# EAGLE design Sensor AFE Explorer Rev1 (EAGLE 6.3)
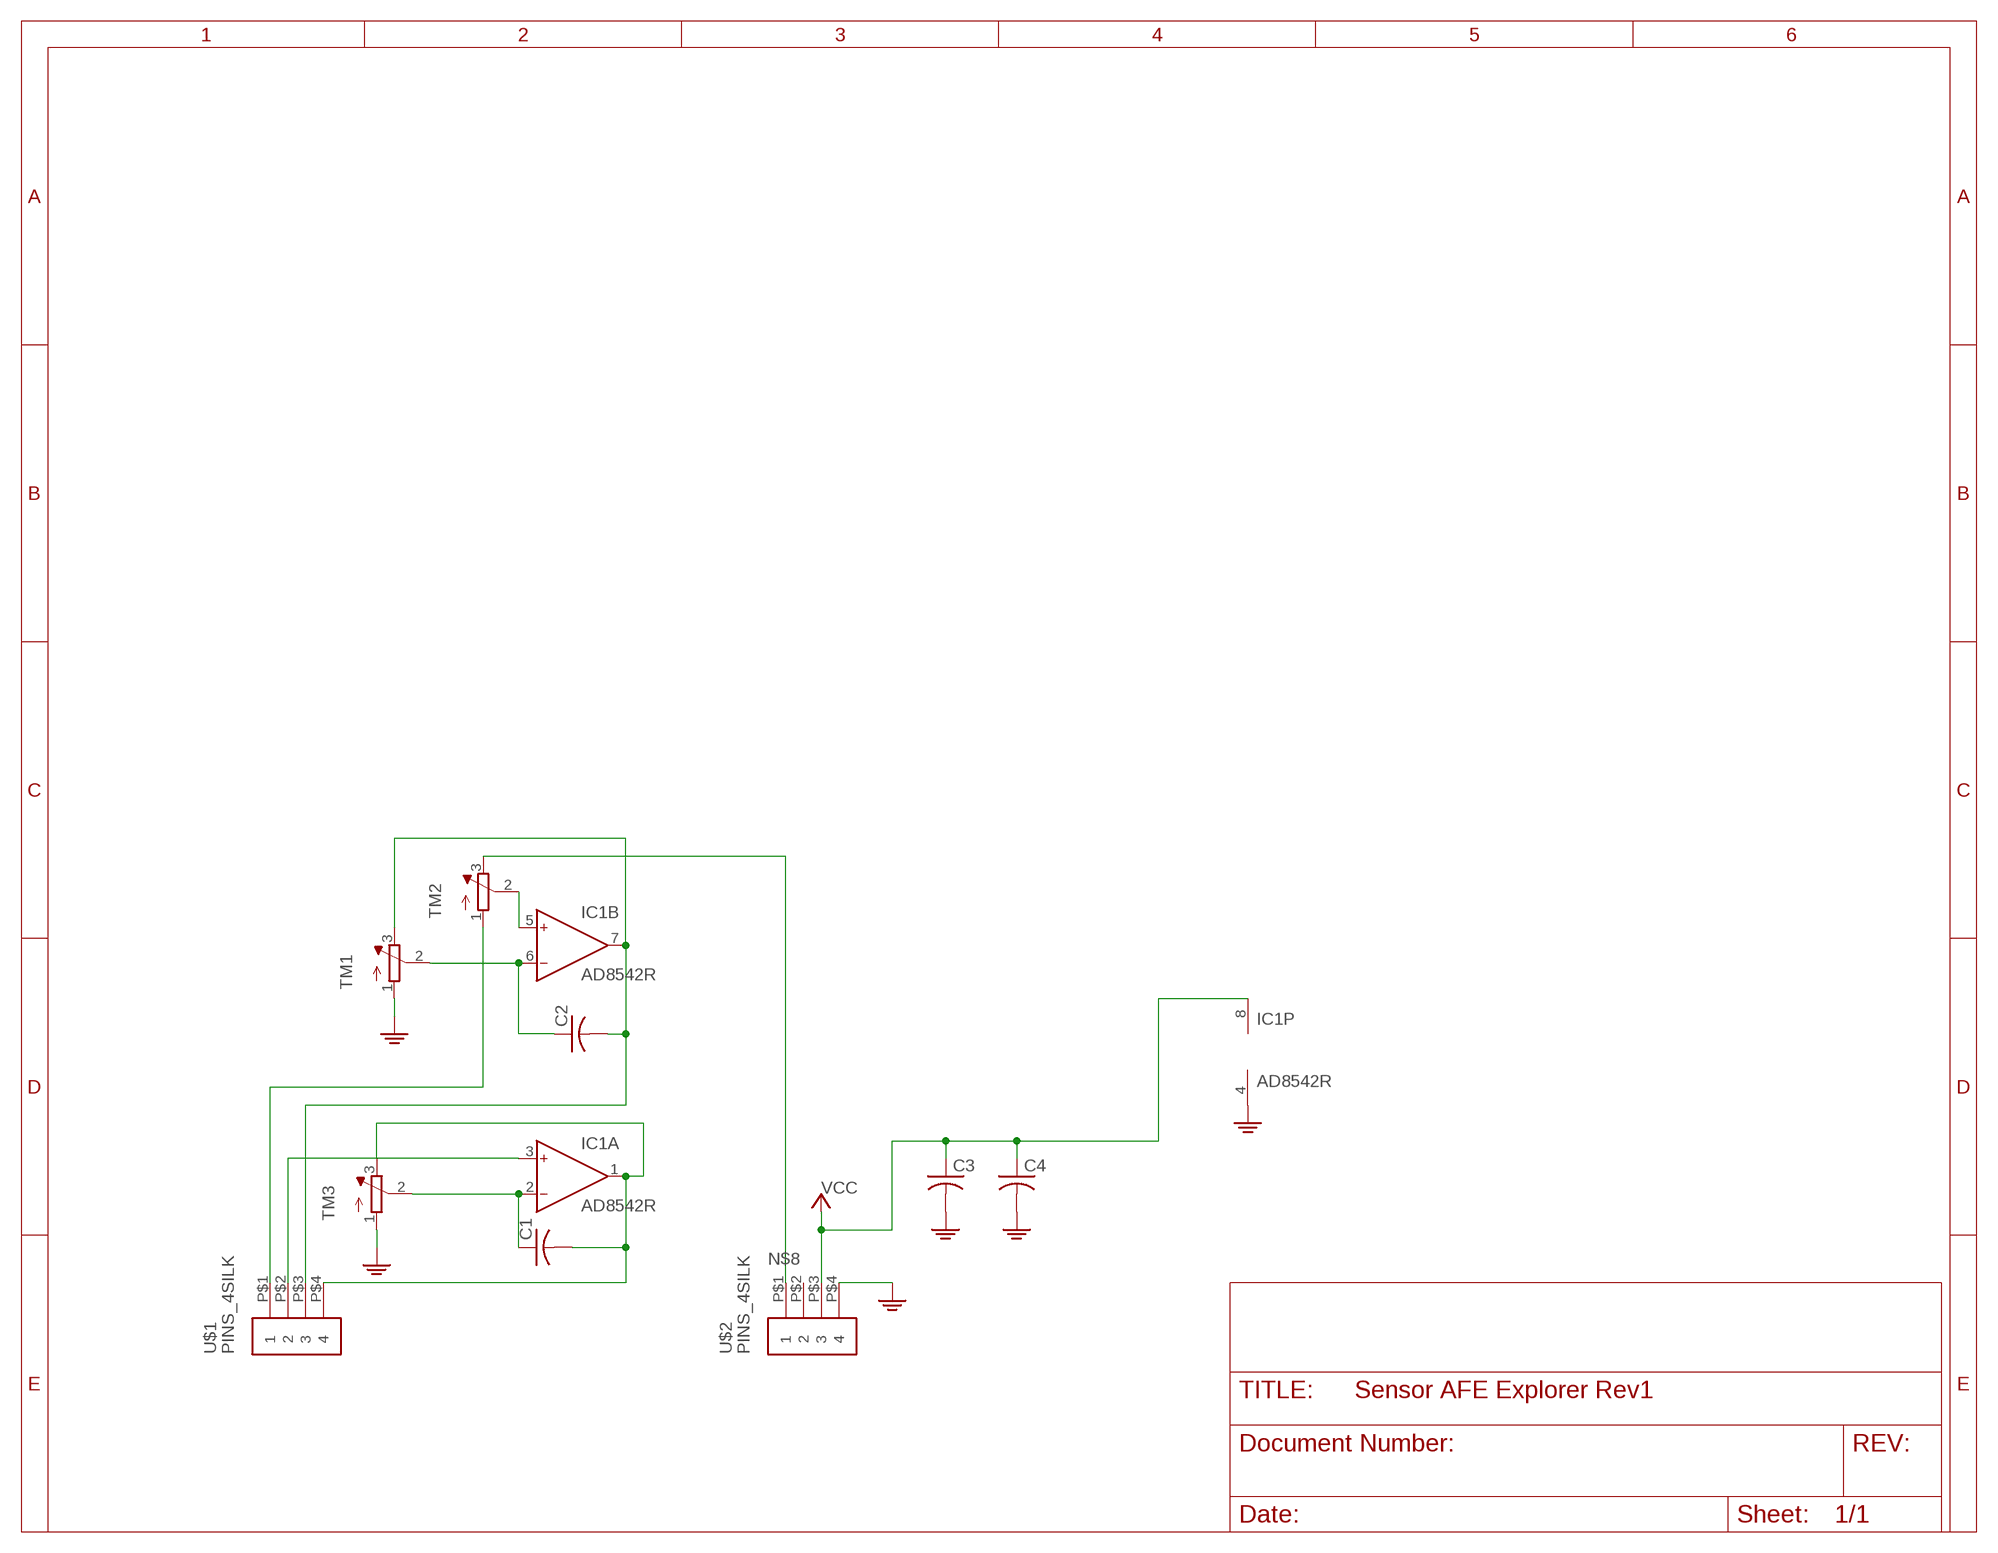
[diagram p0: schematic, sheet 1]

## Parts
C1  C-USC0805  [C0805]
C2  C-USC0805  [C0805]
C3  C-USC0805  [C0805]
C4  C-USC0805  [C0805]
IC1  AD8542R  [SO8]
TM1  TRIMPOT3386  [TRIM-3386]
TM2  TRIMPOT3386  [TRIM-3386]
TM3  TRIMPOT3386  [TRIM-3386]
U$1  PINS_4SILK  [PCB_4]
U$2  PINS_4SILK  [PCB_4]

## Nets
GND: C3.2 C4.2 IC1.4(P:V-) TM1.1(A) TM3.1(A) U$2.P$4
N$1: C2.1 IC1.6(B:IN-) TM1.2(S)
N$2: C2.2 IC1.7(B:OUT) TM1.3(E) U$1.P$3
N$3: C1.1 IC1.2(A:IN-) TM3.2(S)
N$4: C1.2 IC1.1(A:OUT) TM3.3(E) U$1.P$4
N$5: IC1.3(A:IN+) U$1.P$2
N$6: TM2.1(A) U$1.P$1
N$7: IC1.5(B:IN+) TM2.2(S)
N$8: TM2.3(E) U$2.P$1
VCC: C3.1 C4.1 IC1.8(P:V+) U$2.P$3
Unconnected: U$2.P$2

## Library data of the parts
C1-C4 = nolan-utsa:C-US: CAPACITOR, American symbol
IC1 = analog-devices:AD8542: General-Purpose CMOS Rail-to-Rail Amplifiers Source: http://www.analog.com/static/imported-files/data_sheets/AD8541_8542_8544.pdf; MF: ALTERA CORPORATION; MPN: AD8542ARZ-REEL; OC_FARNELL: 1424150; OC_NEWARK: 59K6827
TM1-TM3 = nolan-utsa:TRIMPOT: SMT trimmer potentiometer part number TC33X http://www.ladyada.net/library/eagle
U$1 U$2 = nolan-utsa:PINS_4

## Board
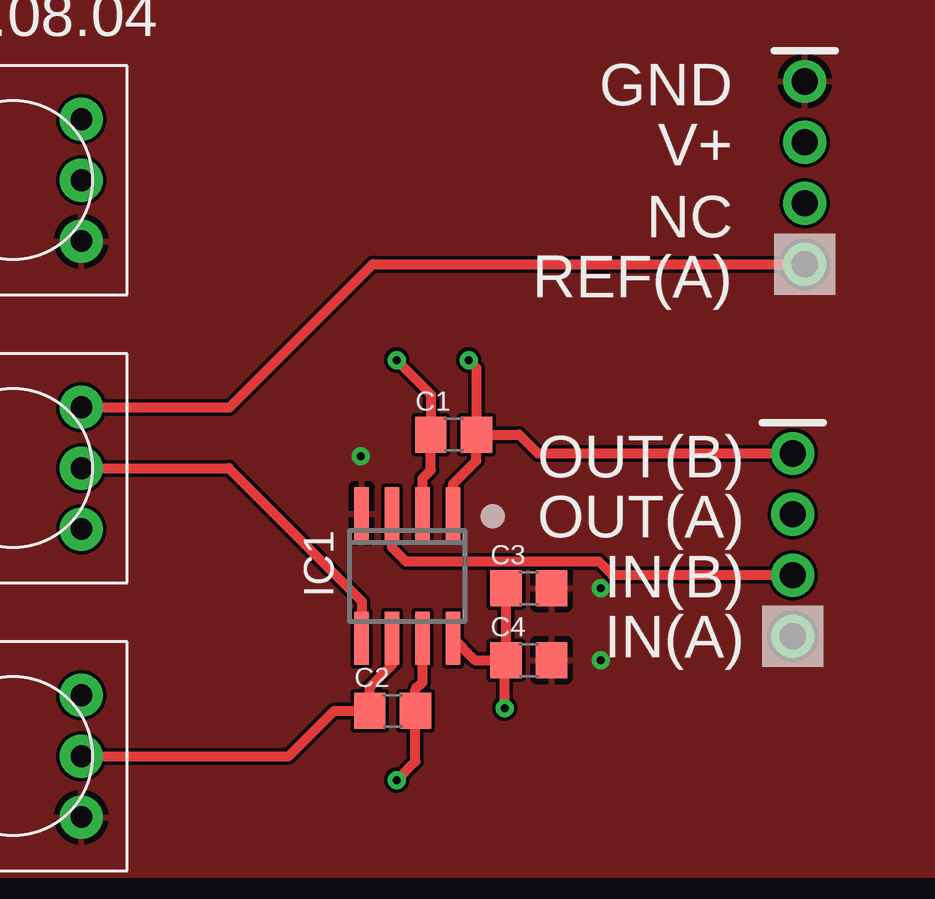
[diagram p1: board, top side]
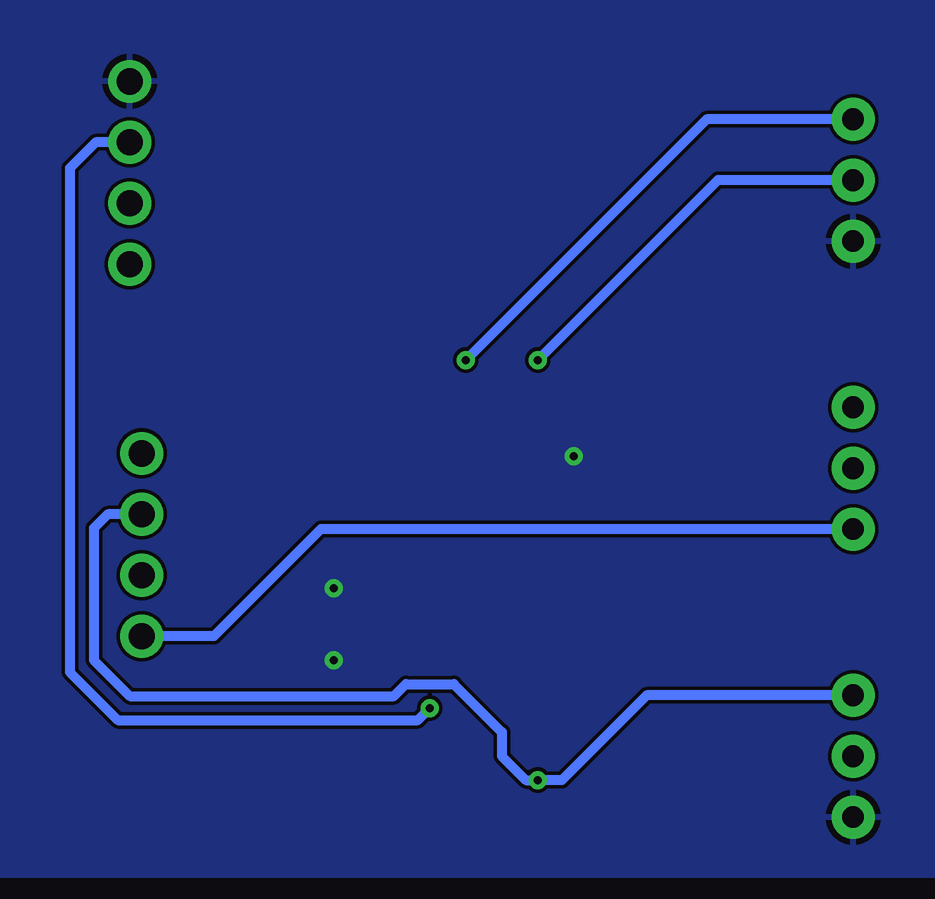
[diagram p2: board, bottom side, seen from below]

No outline drawn. Coordinates in mm, seen from the top.
Copper layers (1*16): Top 0.035mm / dielectric 1.5mm / Bottom 0.035mm
Design rules "default": minimum track width 6mil, minimum drill 0.35mm, track to track 6mil, track to pad 6mil, pad to pad 6mil, via to via 6mil, smd to smd 6mil, copper to edge 40mil, drill to drill 6mil, minimum pad ring 10mil, minimum via ring 8mil, stop-mask expansion 4mil, vias tented up to drill 0mil, thermal gap 10mil

### Footprints (pad centres in the part's own frame; a part is rotated, then mirrored left to right if it is on the bottom)
C0805 = smd 1.3 x 1.5: 1 -0.95,0; 2 0.95,0
SO8 = smd 0.6 x 2.2: 1 -1.905,-2.6; 2 -0.635,-2.6; 3 0.635,-2.6; 4 1.905,-2.6; 5 1.905,2.6; 6 0.635,2.6; 7 -0.635,2.6; 8 -1.905,2.6
TRIM-3386 = drill 0.9 pad 1.778: 1 -2.54,-2.857; 2 0,-2.857; 3 2.54,-2.857
PCB_4 = drill 1.1 pad 1.778: P$1 0,0; P$2 0,-2.54; P$3 0,-5.08; P$4 0,-7.62

### Placement (x,y rotation side)
C1  26.87,19.4 0 top
C2  24.33,7.89 0 top
C3  30,13 0 top
C4  30,10 0 top
IC1  24.94,13.51 180 top
TM1  8.5,6 90 top
TM2  8.5,18 90 top
TM3  8.5,30 90 top
U$1  41,11 180 top
U$2  41.5,26.5 180 top

### Tracks (layer width: path | path; a pad name or v marks a point on that pad's centre or on a via)
GND  (via drill 0.35)
  other vias: 33,13 33,10 23,18.5
  pour Top: 1,1 1,44 49,44 49,1
  pour Bottom: 1,1 1,44 49,44 49,1
N$1
  Top 0.152: C2.1 23.33,7.84
  Top 0.406: TM1.2 20,6 21.89,7.89 C2.1 23.38,8.88 24.3,9.8 IC1.6
N$2  (via drill 0.35)
  Top 0.152: 25.34,8.09 C2.2
  Top 0.406: IC1.7 25.57,9.07 25.28,8.78 C2.2 25.28,5.78 v24.5,5
  Bottom 0.406: TM1.3 19.96,8.54 23.5,5 v24.5,5 25,5 26,6 26,7 28,9 30,9 30.5,8.5 41.5,8.5 43,10 43,15.5 42.42,16.08 U$1.P$3
N$3  (via drill 0.35)
  Top 0.152: 25.91,19.3 C1.1 | 25.65,16.2 IC1.2
  Top 0.406: IC1.2 25.57,17.57 25.92,17.92 C1.1 25.92,21.08 v24.5,22.5
  Bottom 0.406: TM3.2 17,30 v24.5,22.5
N$4  (via drill 0.35)
  Top 0.152: 27.89,19.3 C1.2
  Top 0.406: IC1.1 26.84,17.34 27.82,18.32 C1.2 | v27.5,22.5 27.82,22.18 C1.2 | C1.2 29.6,19.4 30.38,18.62 U$1.P$4
  Bottom 0.406: TM3.3 17.46,32.54 v27.5,22.5
N$5
  Top 0.152: 24.43,16.05 IC1.3
  Top 0.406: U$1.P$2 33.5,13.54 32.93,14.11 24.89,14.11 24.3,14.7 IC1.3
N$6
  Bottom 0.406: TM2.1 33.54,15.46 38,11 U$1.P$1
N$7
  Top 0.406: TM2.2 17.5,18 23.04,12.46 IC1.5
N$8
  Top 0.406: TM2.3 17.54,20.54 23.5,26.5 U$2.P$1
VCC  (via drill 0.35)
  Top 0.406: C3.1 C4.1 | IC1.8 27.75,10 C4.1 | v29,8 29,9.95 C4.1
  Bottom 0.406: U$2.P$3 42.92,31.58 44,30.5 44,9.5 42,7.5 29.5,7.5 v29,8

### Text on the board
tPlace: Sensor AFE Explorer | Rev.1 | 2021.08.04 | GND | V+ | NC | REF(A) | OUT(B) | OUT(A) | IN(B) | IN(A)